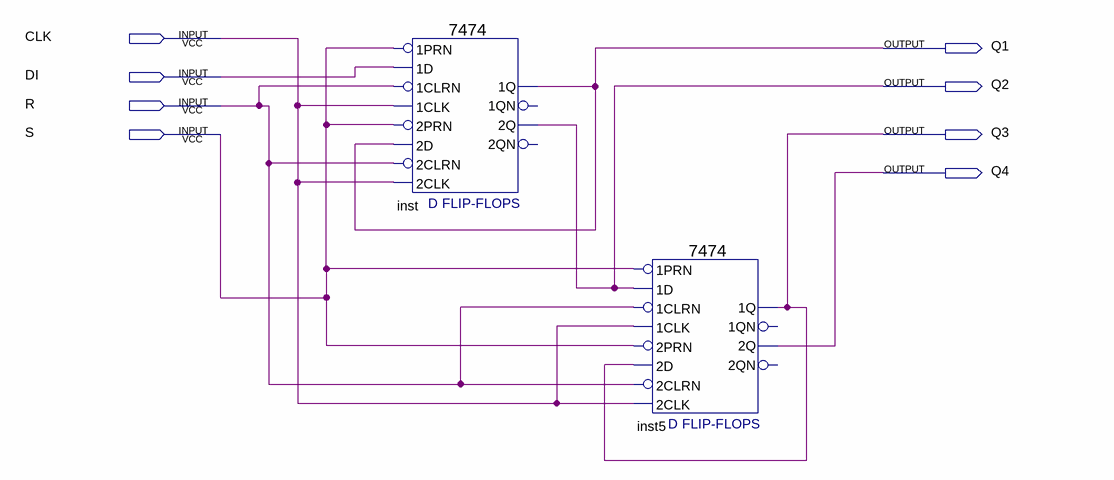
[diagram p0: schematic sheet]
// Quartus schematic w6.bdf as structural Verilog: 2 symbols, 8 pins
module w6 (
  input  CLK,
  input  DI,
  input  R,
  input  S,
  output Q1,
  output Q2,
  output Q3,
  output Q4
);

  \7474  inst (
    .\2D (Q1), .\2PRN (S), .\1CLK (CLK), .\1D (DI), .\1PRN (S), .\2CLK (CLK), .\2CLRN (R), .\1CLRN (R),
    .\2Q (Q2), .\1Q (Q1));  // open: 1QN, 2QN
  \7474  inst5 (
    .\2D (Q3), .\2PRN (S), .\1CLK (CLK), .\1D (Q2), .\1PRN (S), .\2CLK (CLK), .\2CLRN (R), .\1CLRN (R),
    .\2Q (Q4), .\1Q (Q3));  // open: 1QN, 2QN
endmodule
